# Altium schematic sheet Nixie.SchDoc
size A3
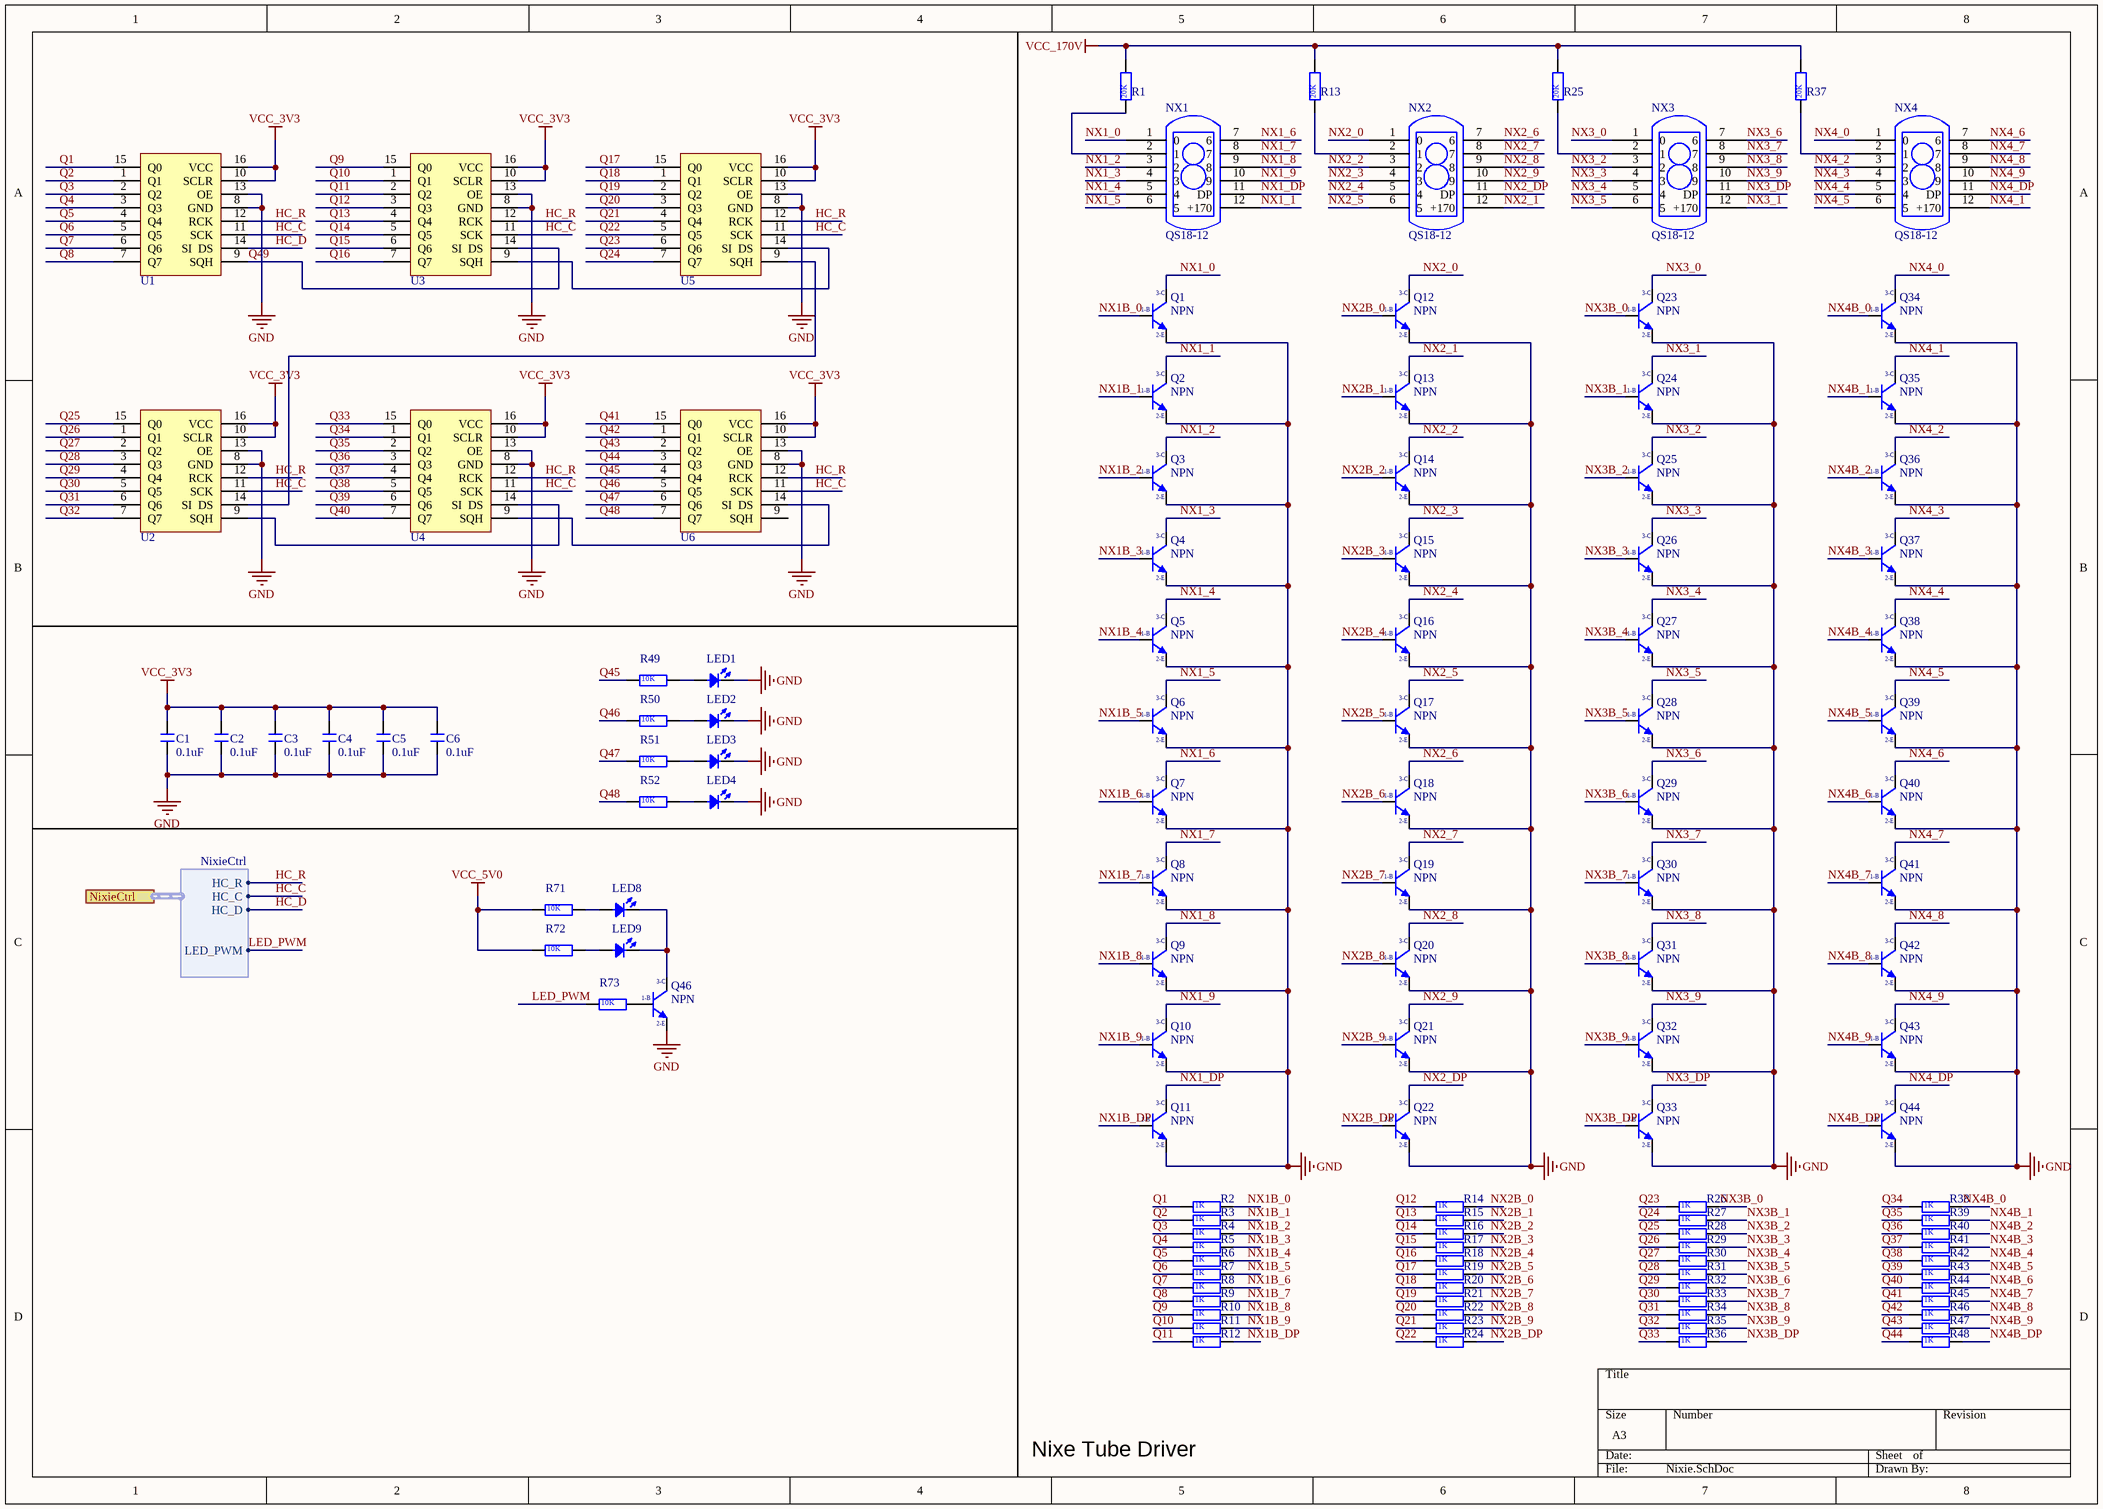
[diagram p0: Nixie.SchDoc]

## Parts
C1  0.1uF  [C 0805]
C2  0.1uF  [C 0805]
C3  0.1uF  [C 0805]
C4  0.1uF  [C 0805]
C5  0.1uF  [C 0805]
C6  0.1uF  [C 0805]
LED1  LED  [0805D]  (value not drawn)
LED2  LED  [0805D]  (value not drawn)
LED3  LED  [0805D]  (value not drawn)
LED4  LED  [0805D]  (value not drawn)
LED8  LED  [LED 5MM-B]  (value not drawn)
LED9  LED  [LED 5MM-B]  (value not drawn)
NX1  QS18-12  [PCBComponent_1]
NX2  QS18-12  [PCBComponent_1]
NX3  QS18-12  [PCBComponent_1]
NX4  QS18-12  [PCBComponent_1]
Q1  NPN  [SOT-23]
Q2  NPN  [SOT-23]
Q3  NPN  [SOT-23]
Q4  NPN  [SOT-23]
Q5  NPN  [SOT-23]
Q6  NPN  [SOT-23]
Q7  NPN  [SOT-23]
Q8  NPN  [SOT-23]
Q9  NPN  [SOT-23]
Q10  NPN  [SOT-23]
Q11  NPN  [SOT-23]
Q12  NPN  [SOT-23]
Q13  NPN  [SOT-23]
Q14  NPN  [SOT-23]
Q15  NPN  [SOT-23]
Q16  NPN  [SOT-23]
Q17  NPN  [SOT-23]
Q18  NPN  [SOT-23]
Q19  NPN  [SOT-23]
Q20  NPN  [SOT-23]
Q21  NPN  [SOT-23]
Q22  NPN  [SOT-23]
Q23  NPN  [SOT-23]
Q24  NPN  [SOT-23]
Q25  NPN  [SOT-23]
Q26  NPN  [SOT-23]
Q27  NPN  [SOT-23]
Q28  NPN  [SOT-23]
Q29  NPN  [SOT-23]
Q30  NPN  [SOT-23]
Q31  NPN  [SOT-23]
Q32  NPN  [SOT-23]
Q33  NPN  [SOT-23]
Q34  NPN  [SOT-23]
Q35  NPN  [SOT-23]
Q36  NPN  [SOT-23]
Q37  NPN  [SOT-23]
Q38  NPN  [SOT-23]
Q39  NPN  [SOT-23]
Q40  NPN  [SOT-23]
Q41  NPN  [SOT-23]
Q42  NPN  [SOT-23]
Q43  NPN  [SOT-23]
Q44  NPN  [SOT-23]
Q46  NPN  [SOT-23]
R1  value 20K  [R 0603]  (hidden comment: R)
R2  value 1K  [R 0603]  (hidden comment: R)
R3  value 1K  [R 0603]  (hidden comment: R)
R4  value 1K  [R 0603]  (hidden comment: R)
R5  value 1K  [R 0603]  (hidden comment: R)
R6  value 1K  [R 0603]  (hidden comment: R)
R7  value 1K  [R 0603]  (hidden comment: R)
R8  value 1K  [R 0603]  (hidden comment: R)
R9  value 1K  [R 0603]  (hidden comment: R)
R10  value 1K  [R 0603]  (hidden comment: R)
R11  value 1K  [R 0603]  (hidden comment: R)
R12  value 1K  [R 0603]  (hidden comment: R)
R13  value 20K  [R 0603]  (hidden comment: R)
R14  value 1K  [R 0603]  (hidden comment: R)
R15  value 1K  [R 0603]  (hidden comment: R)
R16  value 1K  [R 0603]  (hidden comment: R)
R17  value 1K  [R 0603]  (hidden comment: R)
R18  value 1K  [R 0603]  (hidden comment: R)
R19  value 1K  [R 0603]  (hidden comment: R)
R20  value 1K  [R 0603]  (hidden comment: R)
R21  value 1K  [R 0603]  (hidden comment: R)
R22  value 1K  [R 0603]  (hidden comment: R)
R23  value 1K  [R 0603]  (hidden comment: R)
R24  value 1K  [R 0603]  (hidden comment: R)
R25  value 20K  [R 0603]  (hidden comment: R)
R26  value 1K  [R 0603]  (hidden comment: R)
R27  value 1K  [R 0603]  (hidden comment: R)
R28  value 1K  [R 0603]  (hidden comment: R)
R29  value 1K  [R 0603]  (hidden comment: R)
R30  value 1K  [R 0603]  (hidden comment: R)
R31  value 1K  [R 0603]  (hidden comment: R)
R32  value 1K  [R 0603]  (hidden comment: R)
R33  value 1K  [R 0603]  (hidden comment: R)
R34  value 1K  [R 0603]  (hidden comment: R)
R35  value 1K  [R 0603]  (hidden comment: R)
R36  value 1K  [R 0603]  (hidden comment: R)
R37  value 20K  [R 0603]  (hidden comment: R)
R38  value 1K  [R 0603]  (hidden comment: R)
R39  value 1K  [R 0603]  (hidden comment: R)
R40  value 1K  [R 0603]  (hidden comment: R)
R41  value 1K  [R 0603]  (hidden comment: R)
R42  value 1K  [R 0603]  (hidden comment: R)
R43  value 1K  [R 0603]  (hidden comment: R)
R44  value 1K  [R 0603]  (hidden comment: R)
R45  value 1K  [R 0603]  (hidden comment: R)
R46  value 1K  [R 0603]  (hidden comment: R)
R47  value 1K  [R 0603]  (hidden comment: R)
R48  value 1K  [R 0603]  (hidden comment: R)
R49  value 10K  [R 0603]  (hidden comment: R)
R50  value 10K  [R 0603]  (hidden comment: R)
R51  value 10K  [R 0603]  (hidden comment: R)
R52  value 10K  [R 0603]  (hidden comment: R)
R71  value 10K  [R 0603]  (hidden comment: R)
R72  value 10K  [R 0603]  (hidden comment: R)
R73  value 10K  [R 0603]  (hidden comment: R)
U1  74HC595  [SOP16_M]  (value not drawn)
U2  74HC595  [SOP16_M]  (value not drawn)
U3  74HC595  [SOP16_M]  (value not drawn)
U4  74HC595  [SOP16_M]  (value not drawn)
U5  74HC595  [SOP16_M]  (value not drawn)
U6  74HC595  [SOP16_M]  (value not drawn)

## Ports
NixieCtrl (harness NixieCtrl)

## Harnesses
NixieCtrl: HC_R, HC_C, HC_D, LED_PWM

## Nets
GND: C1.2 C2.2 C3.2 C4.2 C5.2 C6.2 LED1.2(K) LED2.2(K) LED3.2(K) LED4.2(K) Q1.2(E) Q2.2(E) Q3.2(E) Q4.2(E) Q5.2(E) Q6.2(E) Q7.2(E) Q8.2(E) Q9.2(E) Q10.2(E) Q11.2(E) Q12.2(E) Q13.2(E) Q14.2(E) Q15.2(E) Q16.2(E) Q17.2(E) Q18.2(E) Q19.2(E) Q20.2(E) Q21.2(E) Q22.2(E) Q23.2(E) Q24.2(E) Q25.2(E) Q26.2(E) Q27.2(E) Q28.2(E) Q29.2(E) Q30.2(E) Q31.2(E) Q32.2(E) Q33.2(E) Q34.2(E) Q35.2(E) Q36.2(E) Q37.2(E) Q38.2(E) Q39.2(E) Q40.2(E) Q41.2(E) Q42.2(E) Q43.2(E) Q44.2(E) Q46.2(E) U1.8(GND) U1.13(OE) U2.8(GND) U2.13(OE) U3.8(GND) U3.13(OE) U4.8(GND) U4.13(OE) U5.8(GND) U5.13(OE) U6.8(GND) U6.13(OE)
VCC_3V3: C1.1 C2.1 C3.1 C4.1 C5.1 C6.1 U1.10(SCLR) U1.16(VCC) U2.10(SCLR) U2.16(VCC) U3.10(SCLR) U3.16(VCC) U4.10(SCLR) U4.16(VCC) U5.10(SCLR) U5.16(VCC) U6.10(SCLR) U6.16(VCC)
VCC_5V0: R71.1 R72.1
VCC_170V: R1.2 R13.2 R25.2 R37.2
HC_C: U1.11(SCK) U2.11(SCK) U3.11(SCK) U4.11(SCK) U5.11(SCK) U6.11(SCK) ; port NixieCtrl.HC_C
HC_D: U1.14(SI__DS) ; port NixieCtrl.HC_D
HC_R: U1.12(RCK) U2.12(RCK) U3.12(RCK) U4.12(RCK) U5.12(RCK) U6.12(RCK) ; port NixieCtrl.HC_R
LED_PWM: R73.1 ; port NixieCtrl.LED_PWM
NX1_0: NX1.1(0) Q1.3(C)
NX1_1: NX1.12(+170) Q2.3(C)
NX1_2: NX1.3(2) Q3.3(C)
NX1_3: NX1.4(3) Q4.3(C)
NX1_4: NX1.5(4) Q5.3(C)
NX1_5: NX1.6(5) Q6.3(C)
NX1_6: NX1.7(6) Q7.3(C)
NX1_7: NX1.8(7) Q8.3(C)
NX1_8: NX1.9(8) Q9.3(C)
NX1_9: NX1.10(9) Q10.3(C)
NX1_DP: NX1.11(DP) Q11.3(C)
NX1B_0: Q1.1(B) R2.2
NX1B_1: Q2.1(B) R3.2
NX1B_2: Q3.1(B) R4.2
NX1B_3: Q4.1(B) R5.2
NX1B_4: Q5.1(B) R6.2
NX1B_5: Q6.1(B) R7.2
NX1B_6: Q7.1(B) R8.2
NX1B_7: Q8.1(B) R9.2
NX1B_8: Q9.1(B) R10.2
NX1B_9: Q10.1(B) R11.2
NX1B_DP: Q11.1(B) R12.2
NX2_0: NX2.1(0) Q12.3(C)
NX2_1: NX2.12(+170) Q13.3(C)
NX2_2: NX2.3(2) Q14.3(C)
NX2_3: NX2.4(3) Q15.3(C)
NX2_4: NX2.5(4) Q16.3(C)
NX2_5: NX2.6(5) Q17.3(C)
NX2_6: NX2.7(6) Q18.3(C)
NX2_7: NX2.8(7) Q19.3(C)
NX2_8: NX2.9(8) Q20.3(C)
NX2_9: NX2.10(9) Q21.3(C)
NX2_DP: NX2.11(DP) Q22.3(C)
NX2B_0: Q12.1(B) R14.2
NX2B_1: Q13.1(B) R15.2
NX2B_2: Q14.1(B) R16.2
NX2B_3: Q15.1(B) R17.2
NX2B_4: Q16.1(B) R18.2
NX2B_5: Q17.1(B) R19.2
NX2B_6: Q18.1(B) R20.2
NX2B_7: Q19.1(B) R21.2
NX2B_8: Q20.1(B) R22.2
NX2B_9: Q21.1(B) R23.2
NX2B_DP: Q22.1(B) R24.2
NX3_0: NX3.1(0) Q23.3(C)
NX3_1: NX3.12(+170) Q24.3(C)
NX3_2: NX3.3(2) Q25.3(C)
NX3_3: NX3.4(3) Q26.3(C)
NX3_4: NX3.5(4) Q27.3(C)
NX3_5: NX3.6(5) Q28.3(C)
NX3_6: NX3.7(6) Q29.3(C)
NX3_7: NX3.8(7) Q30.3(C)
NX3_8: NX3.9(8) Q31.3(C)
NX3_9: NX3.10(9) Q32.3(C)
NX3_DP: NX3.11(DP) Q33.3(C)
NX3B_0: Q23.1(B) R26.2
NX3B_1: Q24.1(B) R27.2
NX3B_2: Q25.1(B) R28.2
NX3B_3: Q26.1(B) R29.2
NX3B_4: Q27.1(B) R30.2
NX3B_5: Q28.1(B) R31.2
NX3B_6: Q29.1(B) R32.2
NX3B_7: Q30.1(B) R33.2
NX3B_8: Q31.1(B) R34.2
NX3B_9: Q32.1(B) R35.2
NX3B_DP: Q33.1(B) R36.2
NX4_0: NX4.1(0) Q34.3(C)
NX4_1: NX4.12(+170) Q35.3(C)
NX4_2: NX4.3(2) Q36.3(C)
NX4_3: NX4.4(3) Q37.3(C)
NX4_4: NX4.5(4) Q38.3(C)
NX4_5: NX4.6(5) Q39.3(C)
NX4_6: NX4.7(6) Q40.3(C)
NX4_7: NX4.8(7) Q41.3(C)
NX4_8: NX4.9(8) Q42.3(C)
NX4_9: NX4.10(9) Q43.3(C)
NX4_DP: NX4.11(DP) Q44.3(C)
NX4B_0: Q34.1(B) R38.2
NX4B_1: Q35.1(B) R39.2
NX4B_2: Q36.1(B) R40.2
NX4B_3: Q37.1(B) R41.2
NX4B_4: Q38.1(B) R42.2
NX4B_5: Q39.1(B) R43.2
NX4B_6: Q40.1(B) R44.2
NX4B_7: Q41.1(B) R45.2
NX4B_8: Q42.1(B) R46.2
NX4B_9: Q43.1(B) R47.2
NX4B_DP: Q44.1(B) R48.2
Q1: R2.1 U1.15(Q0)
Q2: R3.1 U1.1(Q1)
Q3: R4.1 U1.2(Q2)
Q4: R5.1 U1.3(Q3)
Q5: R6.1 U1.4(Q4)
Q6: R7.1 U1.5(Q5)
Q7: R8.1 U1.6(Q6)
Q8: R9.1 U1.7(Q7)
Q9: R10.1 U3.15(Q0)
Q10: R11.1 U3.1(Q1)
Q11: R12.1 U3.2(Q2)
Q12: R14.1 U3.3(Q3)
Q13: R15.1 U3.4(Q4)
Q14: R16.1 U3.5(Q5)
Q15: R17.1 U3.6(Q6)
Q16: R18.1 U3.7(Q7)
Q17: R19.1 U5.15(Q0)
Q18: R20.1 U5.1(Q1)
Q19: R21.1 U5.2(Q2)
Q20: R22.1 U5.3(Q3)
Q21: R23.1 U5.4(Q4)
Q22: R24.1 U5.5(Q5)
Q23: R26.1 U5.6(Q6)
Q24: R27.1 U5.7(Q7)
Q25: R28.1 U2.15(Q0)
Q26: R29.1 U2.1(Q1)
Q27: R30.1 U2.2(Q2)
Q28: R31.1 U2.3(Q3)
Q29: R32.1 U2.4(Q4)
Q30: R33.1 U2.5(Q5)
Q31: R34.1 U2.6(Q6)
Q32: R35.1 U2.7(Q7)
Q33: R36.1 U4.15(Q0)
Q34: R38.1 U4.1(Q1)
Q35: R39.1 U4.2(Q2)
Q36: R40.1 U4.3(Q3)
Q37: R41.1 U4.4(Q4)
Q38: R42.1 U4.5(Q5)
Q39: R43.1 U4.6(Q6)
Q40: R44.1 U4.7(Q7)
Q41: R45.1 U6.15(Q0)
Q42: R46.1 U6.1(Q1)
Q43: R47.1 U6.2(Q2)
Q44: R48.1 U6.3(Q3)
Q45: R49.1 U6.4(Q4)
Q46: R50.1 U6.5(Q5)
Q47: R51.1 U6.6(Q6)
Q48: R52.1 U6.7(Q7)
Q49: U1.9(SQH) U3.14(SI__DS)
NetLED1_1: LED1.1(A) R49.2
NetLED2_1: LED2.1(A) R50.2
NetLED3_1: LED3.1(A) R51.2
NetLED4_1: LED4.1(A) R52.2
NetLED8_1: LED8.1(A) R71.2
NetLED8_2: LED8.2(K) LED9.2(K) Q46.3(C)
NetLED9_1: LED9.1(A) R72.2
NetNX1_2: NX1.2(1) R1.1
NetNX2_2: NX2.2(1) R13.1
NetNX3_2: NX3.2(1) R25.1
NetNX4_2: NX4.2(1) R37.1
NetQ46_1: Q46.1(B) R73.2
NetU2_9: U2.9(SQH) U4.14(SI__DS)
NetU2_14: U2.14(SI__DS) U5.9(SQH)
NetU3_9: U3.9(SQH) U5.14(SI__DS)
NetU4_9: U4.9(SQH) U6.14(SI__DS)

Not connected (* = marked no-connect by the designer): U6 9(SQH)

## Notes on the sheet
- Nixe Tube Driver
- (in symbol NPN-S8050-SOT-23) 3-C; 1-B; 2-E

## Library data of the parts
C1-C6 = C: 无极性贴片电容; 版权归属: 源创客; BOM名称: 无极性贴片电容; 学习资源: www.ooocke.com
Q1-Q44 Q46 = NPN-S8050-SOT-23
U1-U6 = 74HC595_1
LED1-LED4 LED8 LED9 = LED: Published: 8-Jun-2000; LatestRevisionDate: 08-Jul-2005; LatestRevisionNote: Mech Layer 1 removed.; PackageReference: LED-0; Publisher: Altium Limited; PackageDescription: LED; 2 Leads